# Altium schematic sheet Mcu.SchDoc
size A4; SheetNumber: 2; SheetTotal: 9
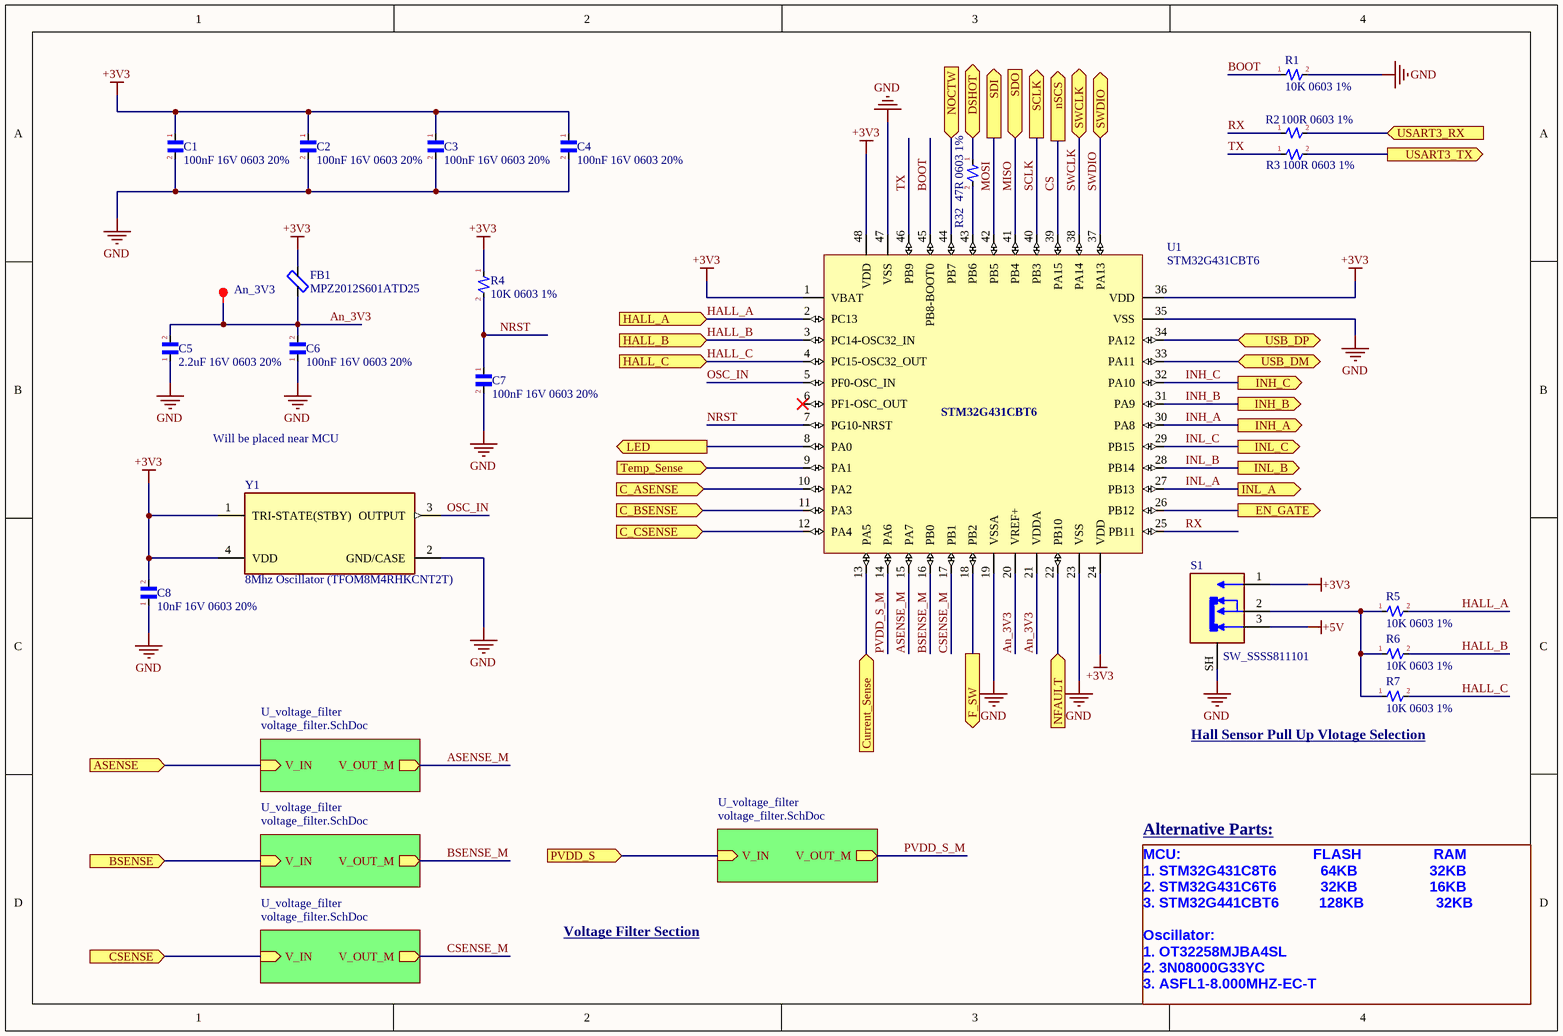
[diagram p0: Mcu.SchDoc]

## Parts
C1  100nF 16V 0603 20%  [C_0603]
C2  100nF 16V 0603 20%  [C_0603]
C3  100nF 16V 0603 20%  [C_0603]
C4  100nF 16V 0603 20%  [C_0603]
C5  2.2uF 16V 0603 20%  [C_0603]
C6  100nF 16V 0603 20%  [C_0603]
C7  100nF 16V 0603 20%  [C_0603]
C8  10nF 16V 0603 20%  [C_0603]
FB1  MPZ2012S601ATD25  [BEADC2012X105N]
R1  10K 0603 1%  [R_0603]
R2  100R 0603 1%  [R_0603]
R3  100R 0603 1%  [R_0603]
R4  10K 0603 1%  [R_0603]
R5  10K 0603 1%  [R_0603]
R6  10K 0603 1%  [R_0603]
R7  10K 0603 1%  [R_0603]
R32  47R 0603 1%  [R_0603]
S1  SW_SSSS811101  [SW_SSSS811101]
TP44  An_3V3  [TP_1mm_SMD]  (graphical)
U1  STM32G431CBT6  [QFP50P900X900X160-48N]
Y1  8Mhz Oscillator (TFOM8M4RHKCNT2T)  [XTAL_ASE-8.000MHZ-LC-T]

## Sub-sheets
U_voltage_filter = voltage_filter.SchDoc: V_OUT_M (out), V_IN (in)
U_voltage_filter = voltage_filter.SchDoc: V_OUT_M (out), V_IN (in)
U_voltage_filter = voltage_filter.SchDoc: V_OUT_M (out), V_IN (in)
U_voltage_filter = voltage_filter.SchDoc: V_OUT_M (out), V_IN (in)

## Ports
ASENSE (in, see TurboSpin[3D]), BSENSE (in, see TurboSpin[3D]), C_ASENSE (in, see TurboSpin[3C]), C_BSENSE (in, see TurboSpin[3C]), C_CSENSE (in, see TurboSpin[3D]), CSENSE (in, see TurboSpin[3D]), Current_Sense (in, see TurboSpin[2B]), DSHOT (bidir, see TurboSpin[2C]), EN_GATE (out, see TurboSpin[3B], Mosfet_Driver[1B]), F_SW (out, see TurboSpin[3C], Current_Shunt_Amplifier[4C], Mosfets[4C]), HALL_A (in, see TurboSpin[2B]), HALL_B (in, see TurboSpin[2B]), HALL_C (in, see TurboSpin[2B]), INH_A (out, see TurboSpin[3B], Mosfet_Driver[1C]), INH_B (out, see TurboSpin[3B], Mosfet_Driver[1C]), INH_C (out, see TurboSpin[3B], Mosfet_Driver[1C]), INL_A (out, see TurboSpin[3B], Mosfet_Driver[1C]), INL_B (out, see TurboSpin[3B], Mosfet_Driver[1C]), INL_C (out, see TurboSpin[3B], Mosfet_Driver[1C]), LED (out, see TurboSpin[2C]), NFAULT (in, see TurboSpin[3B], Mosfet_Driver[1B]), NOCTW (in, see TurboSpin[3B], Mosfet_Driver[1B]), nSCS (out, see TurboSpin[3B], Mosfet_Driver[1B]), PVDD_S (in, see TurboSpin[2B]), SCLK (out, see TurboSpin[3B], Mosfet_Driver[1B]), SDI (out, see TurboSpin[3C], Mosfet_Driver[1B]), SDO (in, see TurboSpin[3C], Mosfet_Driver[1B]), SWCLK (bidir, see TurboSpin[2C]), SWDIO (bidir, see TurboSpin[2C]), Temp_Sense (in, see TurboSpin[2D], Temperature Sensor[3B]), USART3_RX (in, see TurboSpin[2D]), USART3_TX (out, see TurboSpin[2D]), USB_DM (bidir, see TurboSpin[2B]), USB_DP (bidir, see TurboSpin[2B])

## Nets
+3V3: C1.1 C2.1 C3.1 C4.1 C8.2 FB1.2 R4.1 S1.1 U1.1(VBAT) U1.24(VDD) U1.36(VDD) U1.48(VDD) Y1.1(TRI-STATE(STBY)) Y1.4(VDD)
+5V: S1.3
GND: C1.2 C2.2 C3.2 C4.2 C5.1 C6.1 C7.2 C8.1 R1.2 S1.SH U1.19(VSSA) U1.23(VSS) U1.35(VSS) U1.47(VSS) Y1.2(GND/CASE)
An_3V3: C5.2 C6.2 FB1.1 TP44.1 U1.20(VREF+) U1.21(VDDA)
ASENSE: port ASENSE, sheet U_voltage_filter/V_IN
ASENSE_M: U1.15(PA7) ; sheet U_voltage_filter/V_OUT_M
BOOT: R1.1 U1.45(PB8-BOOT0)
BSENSE: port BSENSE, sheet U_voltage_filter/V_IN
BSENSE_M: U1.16(PB0) ; sheet U_voltage_filter/V_OUT_M
C_ASENSE: U1.10(PA2) ; port C_ASENSE
C_BSENSE: U1.11(PA3) ; port C_BSENSE
C_CSENSE: U1.12(PA4) ; port C_CSENSE
CS: U1.39(PA15) ; port nSCS
CSENSE: port CSENSE, sheet U_voltage_filter/V_IN
CSENSE_M: U1.17(PB1) ; sheet U_voltage_filter/V_OUT_M
Current_Sense: U1.13(PA5) ; port Current_Sense
DSHOT: R32.1 ; port DSHOT
EN_GATE: U1.26(PB12) ; port EN_GATE
F_SW: U1.18(PB2) ; port F_SW
HALL_A: R5.2 U1.2(PC13) ; port HALL_A
HALL_B: R6.2 U1.3(PC14-OSC32_IN) ; port HALL_B
HALL_C: R7.2 U1.4(PC15-OSC32_OUT) ; port HALL_C
INH_A: U1.30(PA8) ; port INH_A
INH_B: U1.31(PA9) ; port INH_B
INH_C: U1.32(PA10) ; port INH_C
INL_A: U1.27(PB13) ; port INL_A
INL_B: U1.28(PB14) ; port INL_B
INL_C: U1.29(PB15) ; port INL_C
LED: U1.8(PA0) ; port LED
MISO: U1.41(PB4) ; port SDO
MOSI: U1.42(PB5) ; port SDI
NFAULT: U1.22(PB10) ; port NFAULT
NOCTW: U1.44(PB7) ; port NOCTW
NRST: C7.1 R4.2 U1.7(PG10-NRST)
OSC_IN: U1.5(PF0-OSC_IN) Y1.3(OUTPUT)
PVDD_S: port PVDD_S, sheet U_voltage_filter/V_IN
PVDD_S_M: U1.14(PA6) ; sheet U_voltage_filter/V_OUT_M
RX: R2.1 U1.25(PB11)
SCLK: U1.40(PB3) ; port SCLK
SWCLK: U1.38(PA14) ; port SWCLK
SWDIO: U1.37(PA13) ; port SWDIO
Temp_Sense: U1.9(PA1) ; port Temp_Sense
TX: R3.1 U1.46(PB9)
USART3_RX: R2.2 ; port USART3_RX
USART3_TX: R3.2 ; port USART3_TX
USB_DM: U1.33(PA11) ; port USB_DM
USB_DP: U1.34(PA12) ; port USB_DP
NetR5_1: R5.1 R6.1 R7.1 S1.2
NetR32_2: R32.2 U1.43(PB6)

Not connected (* = marked no-connect by the designer): U1 6(PF1-OSC_OUT)*

## Notes on the sheet
- Will be placed near MCU
- (near R7) Hall Sensor Pull Up Vlotage Selection
- Alternative Parts:
- Voltage Filter Section
- MCU:                                 FLASH                  RAM
  1. STM32G431C8T6           64KB                  32KB
  2. STM32G431C6T6           32KB                  16KB
  3. STM32G441CBT6          128KB                  32KB
  Oscillator:
  1. OT32258MJBA4SL
  2. 3N08000G33YC
  3. ASFL1-8.000MHZ-EC-T

## Library data of the parts
C1-C8 = Capacitor>> Non-Polar: CAP  0603 20%
FB1 = FB>>MPZ2012S601ATD25: 600 Ohms @ 100MHz 1 Power Line Ferrite Bead 0805 (2012 Metric) 2A 100mOhm; MF: TDK; Value: *; SnapEDA_Link: https://www.snapeda.com/parts/MPZ2012S601ATD25/TDK-Lambda%20Americas%20Inc/view-part/347055/?ref=snap; MP: MPZ2012S601ATD25; Purchase-URL: https://pricing.snapeda.com/search/part/MPZ2012S601ATD25/?ref=eda; Check_prices: https://www.snapeda.com/parts/MPZ2012S601ATD25/TDK-Lambda%20Americas%20Inc/view-part/347055/?ref=eda; Availability: Warning; Price: None; Package: 0805 TDK
R1-R7 R32 = Resistor>> General Purpose: RES 0603 20%
S1 = SW_SSSS811101: Switch Slide SP Side Slide 0.3A 5VDC 10000Cycles Gull Wing SMD T/R; MF: ALPS; SnapEDA_Link: https://www.snapeda.com/parts/SSSS811101/ALPS/view-part/?ref=snap; Package: None; Value: *; MP: SSSS811101; Check_prices: https://www.snapeda.com/parts/SSSS811101/ALPS/view-part/?ref=eda
TP44 = Test point TP
Y1 = Osc>>ASE-8.000MHZ-LC-T: 8 MHz XO (Standard) CMOS Oscillator 3.3V Enable/Disable 4-SMD, No Lead; MF: Abracon LLC; Purchase-URL: https://pricing.snapeda.com/search/part/ASE-8.000MHZ-LC-T/?ref=eda; SnapEDA_Link: https://www.snapeda.com/parts/ASE-8.000MHZ-LC-T/Abracon+LLC/view-part/?ref=snap; Value: *; MP: ASE-8.000MHZ-LC-T; Check_prices: https://www.snapeda.com/parts/ASE-8.000MHZ-LC-T/Abracon+LLC/view-part/?ref=eda; Package: SMD-4 Abracon LLC; Availability: In Stock; Price: None